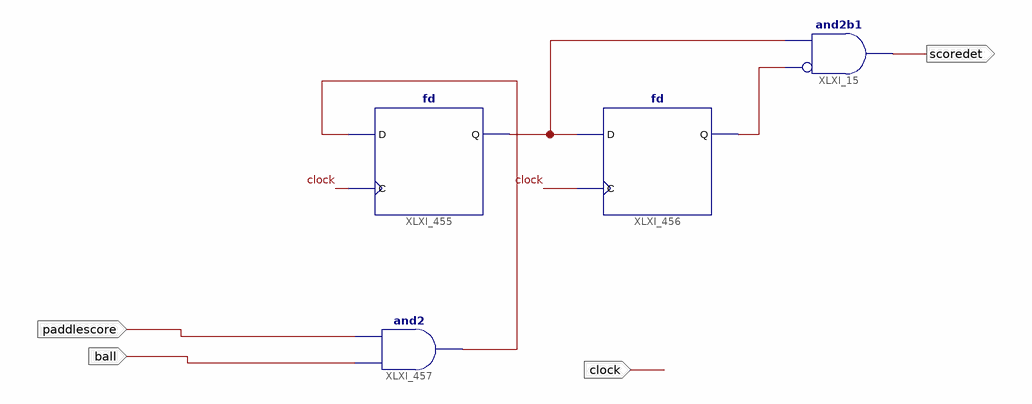
[diagram p0: schematic sheet 1]
// Xilinx ISE schematic scoredetect.sch (spartan3e) as structural Verilog: 4 symbols, 4 ports
module scoredetect (
  input  clock,
  input  paddlescore,
  input  ball,
  output scoredet
);

  wire XLXN_56, XLXN_57, XLXN_62;

  and XLXI_15 (scoredet, ~XLXN_57, XLXN_56);  // and2b1
  fd XLXI_455 (.C(clock), .D(XLXN_62), .Q(XLXN_56));
  fd XLXI_456 (.C(clock), .D(XLXN_56), .Q(XLXN_57));
  and XLXI_457 (XLXN_62, ball, paddlescore);
endmodule
